# EAGLE design atas (EAGLE 9.3.1)
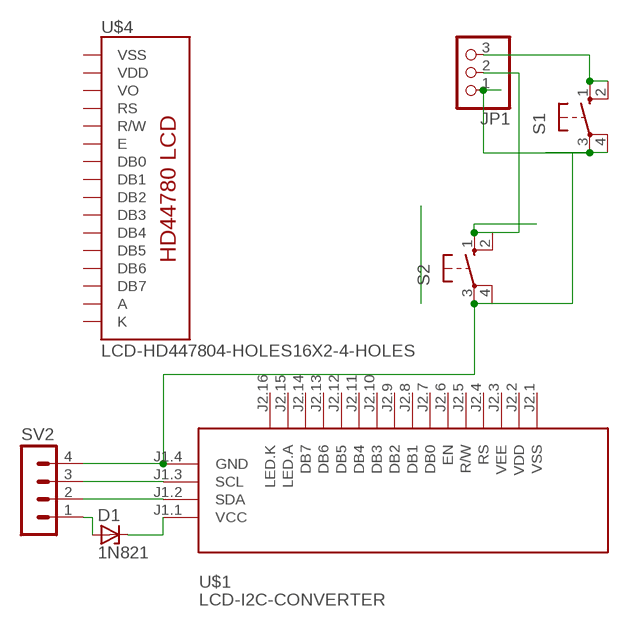
[diagram p0: schematic, sheet 1]

## Parts
D1  1N821  [DO35Z10]
JP1  PINHD-1X3/90  [1X03/90]
S1  10-XX  [B3F-10XX]
S2  10-XX  [B3F-10XX]
SV2  MA04-1  [MA04-1]
U$1  LCD-I2C-CONVERTER  [LCD-I2C-CONVERTER]
U$4  LCD-HD447804-HOLES16X2-4-HOLES  [LCD-16X2-4HOLES]

## Nets
N$1: JP1.3 S1.1(S) S1.2(S1)
N$3: JP1.2 S2.1(S) S2.2(S1)
N$4: JP1.1 S1.3(P) S1.4(P1) S2.3(P) S2.4(P1) SV2.4 U$1.J1.4(GND)
N$5: D1.A SV2.1
N$6: SV2.3 U$1.J1.3(SCL)
N$7: SV2.2 U$1.J1.2(SDA)
N$8: D1.C U$1.J1.1(VCC)
Unconnected: U$1.J2.1(VSS) U$1.J2.2(VDD) U$1.J2.3(VEE) U$1.J2.4(RS) U$1.J2.5(R/W) U$1.J2.6(EN) U$1.J2.7(DB0) U$1.J2.8(DB1) U$1.J2.9(DB2) U$1.J2.10(DB3) U$1.J2.11(DB4) U$1.J2.12(DB5) U$1.J2.13(DB6) U$1.J2.14(DB7) U$1.J2.15(LED.A) U$1.J2.16(LED.K) U$4.3(VO) U$4.4(RS) U$4.5(R/W) U$4.6(E) U$4.7(DB0) U$4.8(DB1) U$4.9(DB2) U$4.10(DB3) U$4.11(DB4) U$4.12(DB5) U$4.13(DB6) U$4.14(DB7)

## Power pins joined to a net without a drawn wire
A: U$4.15(A)
K: U$4.16(K)
VDD: U$4.2(VDD)
VSS: U$4.1(VSS)

## Library data of the parts
D1 = diode:1N821: Reference DIODE temperature compensated, 6,2 V
JP1 = pinhead:PINHD-1X3: PIN HEADER
S1 S2 = switch-omron:10-XX: OMRON SWITCH; MPN: B3F-1000; OC_FARNELL: 176432; OC_NEWARK: 36M3542
SV2 = con-lstb:MA04-1: PIN HEADER; OC_FARNELL: unknown; OC_NEWARK: unknown
U$1 = diy-modules+i2c:LCD-I2C-CONVERTER: I2C Bus to 4-Bit Parallel LCD Interface with LED backlight driver
U$4 = LCD:LCD-HD44780

## Board
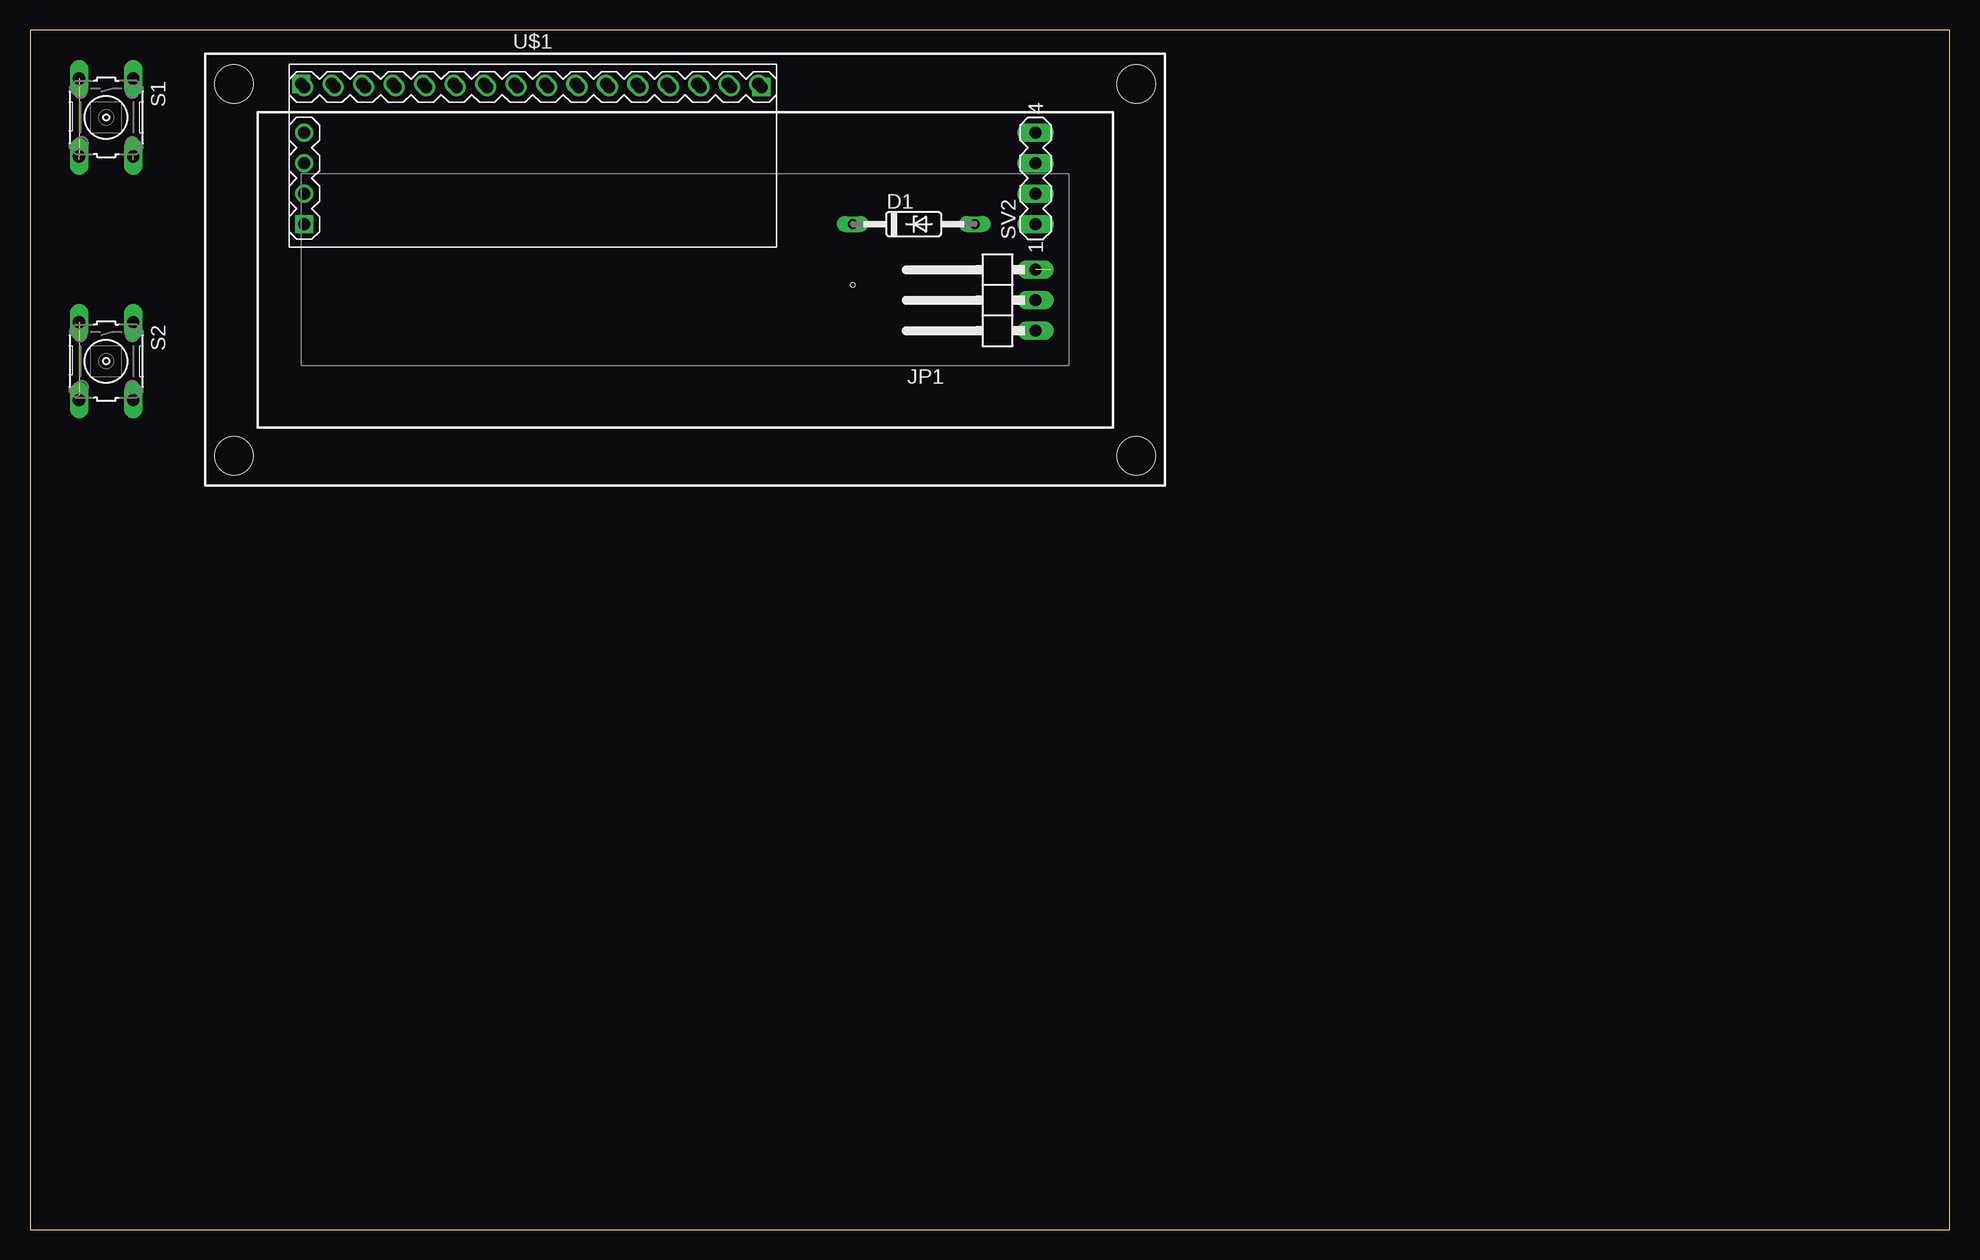
[diagram p1: board, top side]
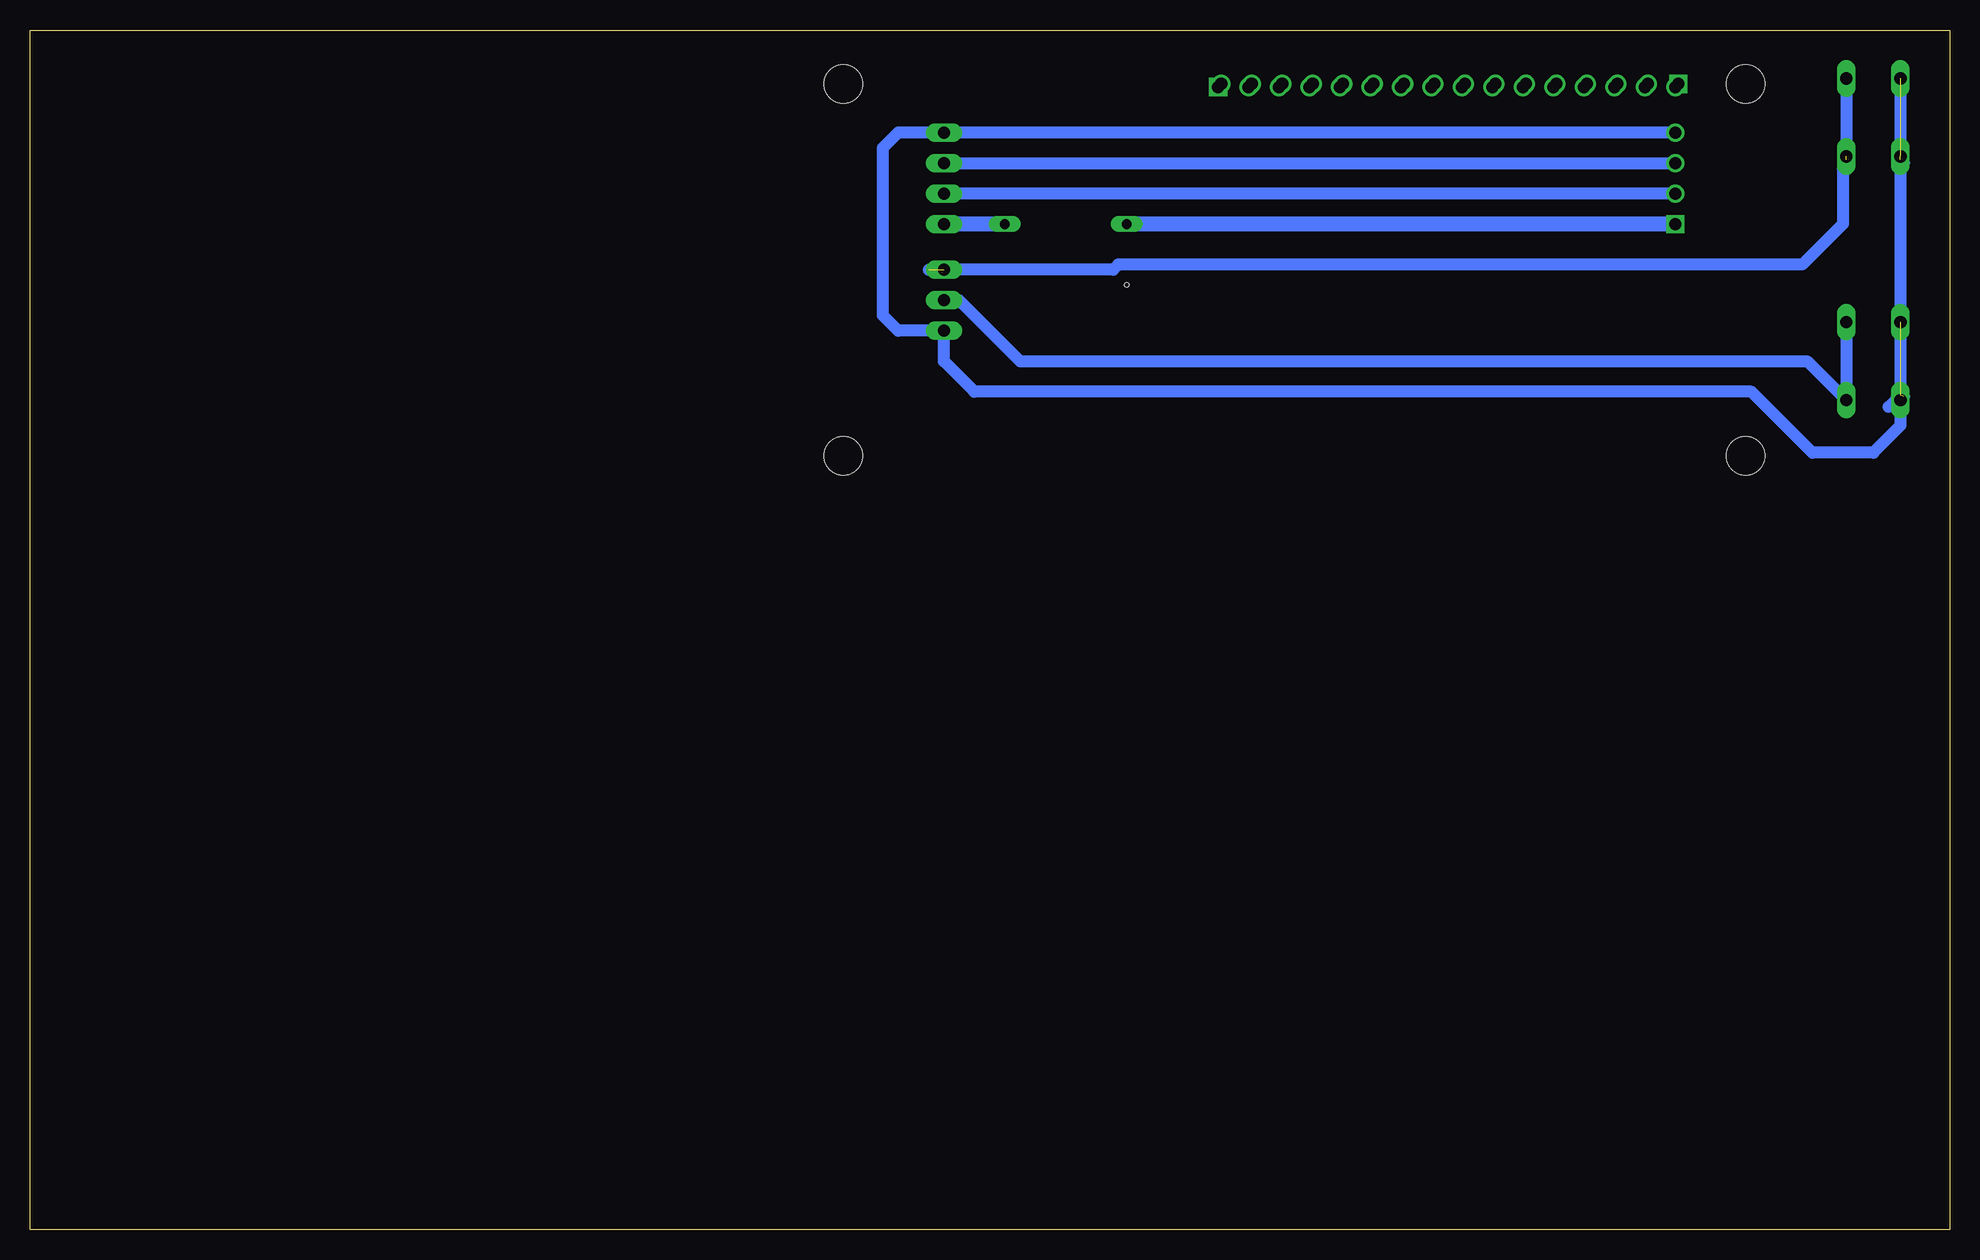
[diagram p2: board, bottom side, seen from below]

Size 160 x 100 mm. Coordinates in mm from the lower left corner, seen from the top.
Outline: 0,0 160,0 160,100 0,100 0,0
Copper layers (1*16): Top 0.035mm / dielectric 1.5mm / Bottom 0.035mm
Design rules "default": minimum track width 6mil, minimum drill 0.35mm, track to track 6mil, track to pad 6mil, pad to pad 6mil, via to via 6mil, smd to smd 6mil, copper to edge 40mil, drill to drill 6mil, minimum pad ring 10mil, minimum via ring 8mil, stop-mask expansion 4mil, vias tented up to drill 0mil, thermal gap 10mil
Holes 0.35 mm at 68.58,78.74

### Footprints (pad centres in the part's own frame; a part is rotated, then mirrored left to right if it is on the bottom)
DO35Z10 = drill 0.813 long: A 5.08,0; C -5.08,0
1X03/90 = drill 1.016 long: 1 -2.54,-3.81; 2 0,-3.81; 3 2.54,-3.81
B3F-10XX = drill 1.016 long: 1 -3.251,2.261; 2 3.251,2.261; 3 -3.251,-2.261; 4 3.251,-2.261
MA04-1 = drill 1.016 long: 1 -3.81,0; 2 -1.27,0; 3 1.27,0; 4 3.81,0
LCD-I2C-CONVERTER = drill 1 square: J1.1 -19.05,-5.08; J2.1 19.05,6.35 | drill 1: J1.2 -19.05,-2.54; J1.3 -19.05,0; J1.4 -19.05,2.54; J2.2 16.51,6.35; J2.3 13.97,6.35; J2.4 11.43,6.35; J2.5 8.89,6.35; J2.6 6.35,6.35; J2.7 3.81,6.35; J2.8 1.27,6.35; J2.9 -1.27,6.35; J2.10 -3.81,6.35; J2.11 -6.35,6.35; J2.12 -8.89,6.35; J2.13 -11.43,6.35; J2.14 -13.97,6.35; J2.15 -16.51,6.35; J2.16 -19.05,6.35
LCD-16X2-4HOLES = drill 1.016 square: 1 -32,15.5 | drill 1.016: 2 -29.46,15.5; 3 -26.92,15.5; 4 -24.38,15.5; 5 -21.84,15.5; 6 -19.3,15.5; 7 -16.76,15.5; 8 -14.22,15.5; 9 -11.68,15.5; 10 -9.14,15.5; 11 -6.6,15.5; 12 -4.06,15.5; 13 -1.52,15.5; 14 1.02,15.5; 15 3.56,15.5; 16 6.1,15.5 | hole 3.2: -37.6,15.5; -37.6,-15.5; 37.6,-15.5; 37.6,15.5

### Placement (x,y rotation side)
D1  73.66,83.82 0 top
JP1  80.01,77.47 90 top
S1  6.35,92.71 270 top
S2  6.35,72.39 270 top
SV2  83.82,87.63 90 top
U$1  41.91,88.9 0 top
U$4  54.61,80.01 0 top

### Tracks (layer width: path | path; a pad name or v marks a point on that pad's centre or on a via)
N$1  (2 unrouted)
  Bottom 1.016: S1.1 8.61,89.18 8.89,88.9 | S1.2 8.89,89.18 8.89,83.82 12.27,80.44 69.28,80.44 69.71,80.01 85.09,80.01
N$3
  Bottom 1.016: S2.1 S2.2 11.86,72.39 77.47,72.39 82.55,77.47 JP1.2
N$4  (4 unrouted)
  Bottom 1.016: 4.09,89.18 3.81,88.9 | 3.81,69.42 S2.4 4.09,67.03 6.35,64.77 11.43,64.77 16.51,69.85 81.28,69.85 83.82,72.39 JP1.1 87.63,74.93 88.9,76.2 88.9,90.17 87.63,91.44 SV2.4 | S1.3 4.09,69.57 5.08,68.58 | U$1.J1.4 SV2.4 | 85.09,91.44 SV2.4
N$5
  Bottom 1.27: D1.A SV2.1
N$6
  Bottom 1.016: SV2.3 U$1.J1.3
N$7
  Bottom 1.016: U$1.J1.2 SV2.2
N$8
  Bottom 1.27: U$1.J1.1 D1.C